# EAGLE design mosquino-power-pjt (EAGLE 5.06)
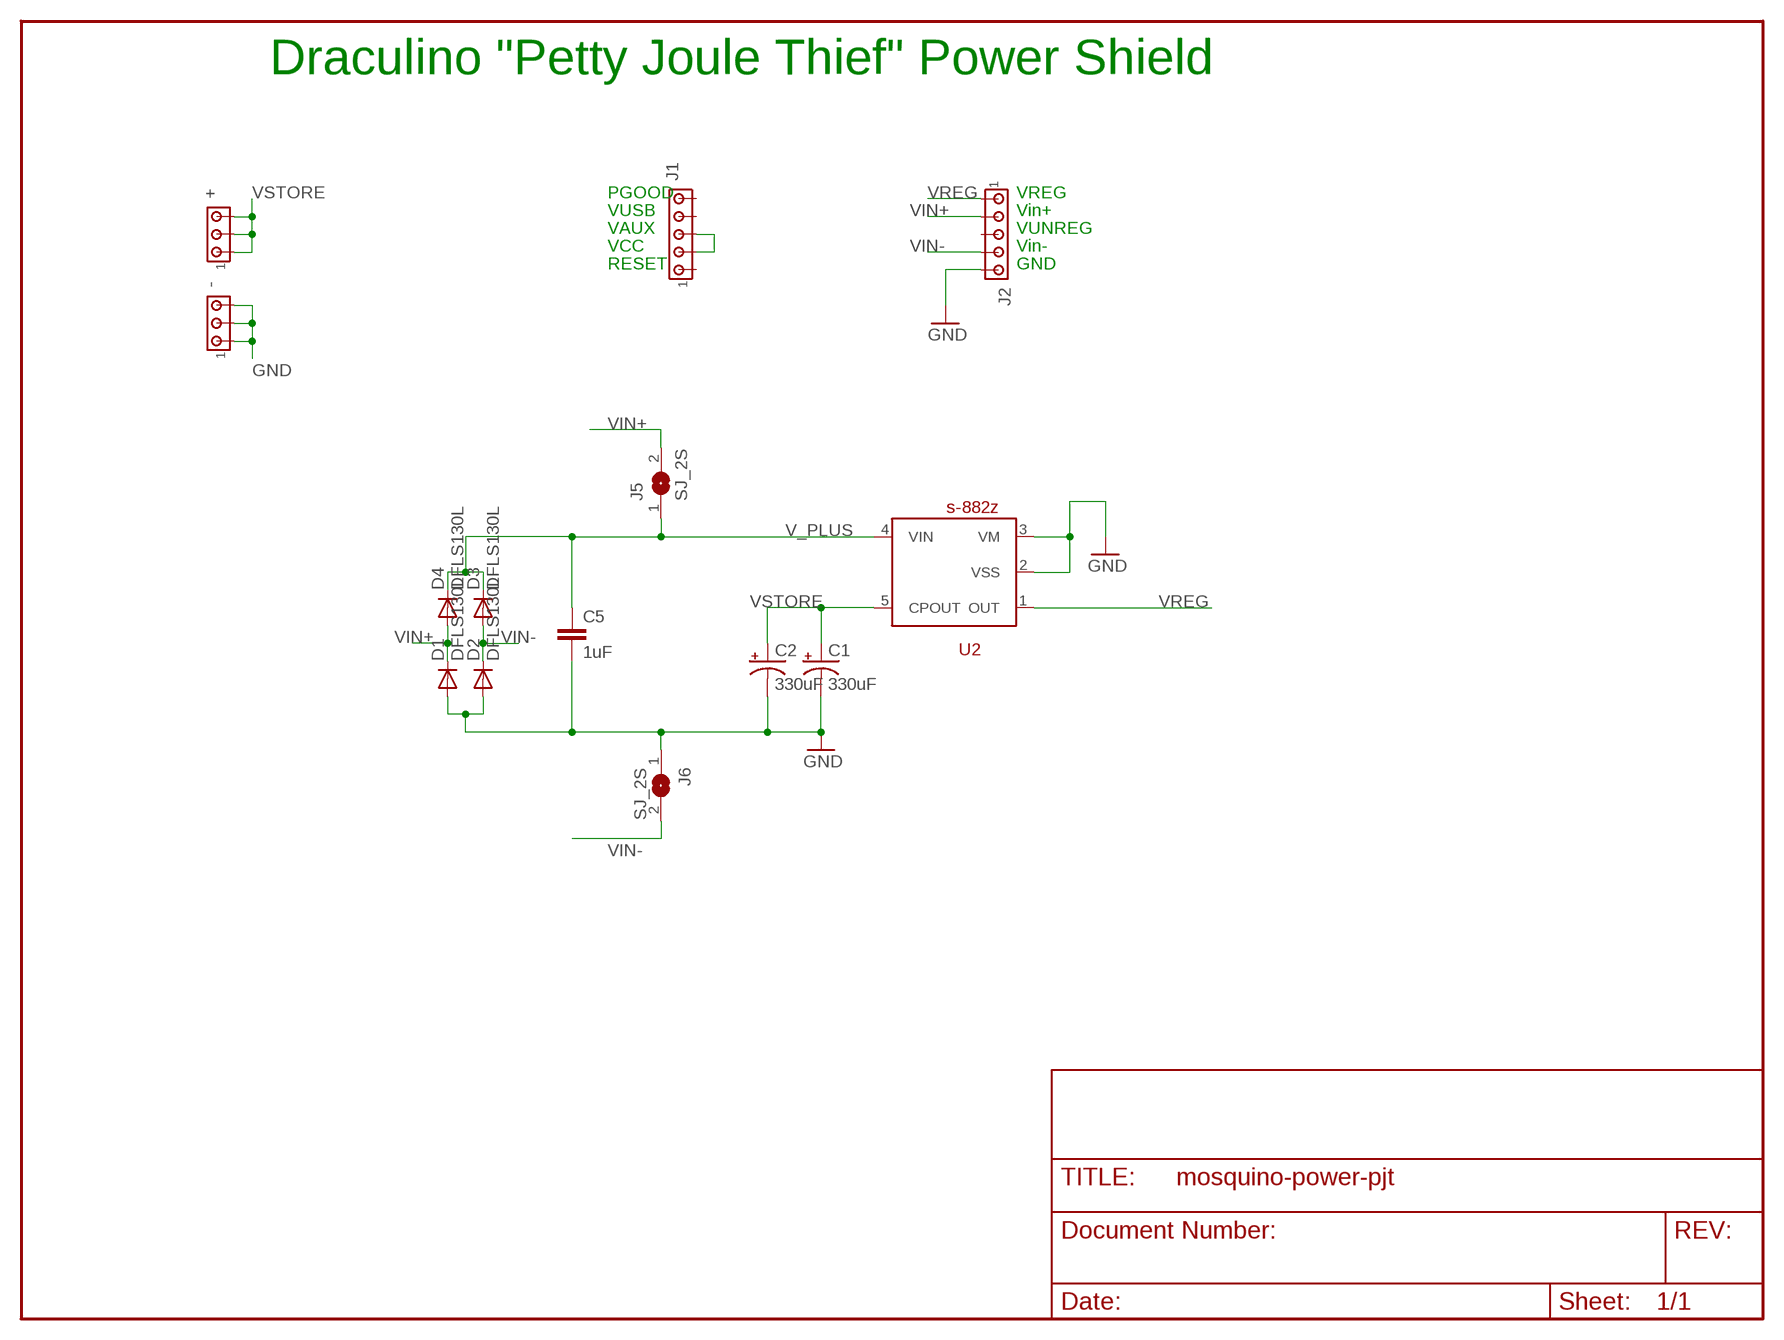
[diagram p0: schematic, sheet 1]

## Parts
+  MTA03-100  [10X03MTA]
-  MTA03-100  [10X03MTA]
C1  330uF  CPOL-USD  [PANASONIC_D]
C2  330uF  CPOL-USD  [PANASONIC_D]
C5  1uF  C-EUC0805  [C0805]
D1  DFLS130L  DIODE-SOD123  [SOD123]
D2  DFLS130L  DIODE-SOD123  [SOD123]
D3  DFLS130L  DIODE-SOD123  [SOD123]
D4  DFLS130L  DIODE-SOD123  [SOD123]
J1  MTA05-100  [10X05MTA]
J2  MTA05-100  [10X05MTA]
J5  SJ_2S  [SJ2_S]
J6  SJ_2S  [SJ2_S]
U2  s-882z  S-882Z  [SOT23-5]

## Nets
GND [pwr]: -.1 -.2 -.3 C1.- C2.- C5.2 D1.A D2.A J2.5 J6.1 U2.2(VSS) U2.3(VM)
N$1 [pwr]: J1.2 J1.3
V_PLUS [pwr]: C5.1 D3.C D4.C J5.1 U2.4(VIN)
VIN+ [pwr]: D1.C D4.A J2.2 J5.2
VIN- [pwr]: D2.C D3.A J2.4 J6.2
VREG [pwr]: J2.1 U2.1(OUT)
VSTORE [pwr]: +.1 +.2 +.3 C1.+ C2.+ U2.5(CPOUT)
Unconnected: J1.1 J1.4 J1.5 J2.3

## Notes on the sheet
- Draculino "Petty Joule Thief" Power Shield
- PGOOD | VREG
- VUSB | Vin+
- VAUX | VUNREG
- VCC | Vin-
- RESET | GND

## Library data of the parts
+ - = con-amp:MTA03-100: AMP connector
C1 C2 = rcl:CPOL-US: POLARIZED CAPACITOR, American symbol
C5 = rcl:C-EU: CAPACITOR, European symbol
D1-D4 = diode:DIODE-: DIODE
J1 J2 = con-amp:MTA05-100: AMP connector
J5 J6 = mideeval:SJ_2S: Small solder jumper, 2 pin. 20060130 / tgipson
U2 = tim:S-882Z: S-882Z series ultralow input voltage step-up converter. 20100817 / tgipson

## Net classes
1 pwr: width 0.305 mm, drill 0.508 mm, clearance 0.203 mm
4 digital: width 0.203 mm, drill 0.381 mm, clearance 0.203 mm

## Board
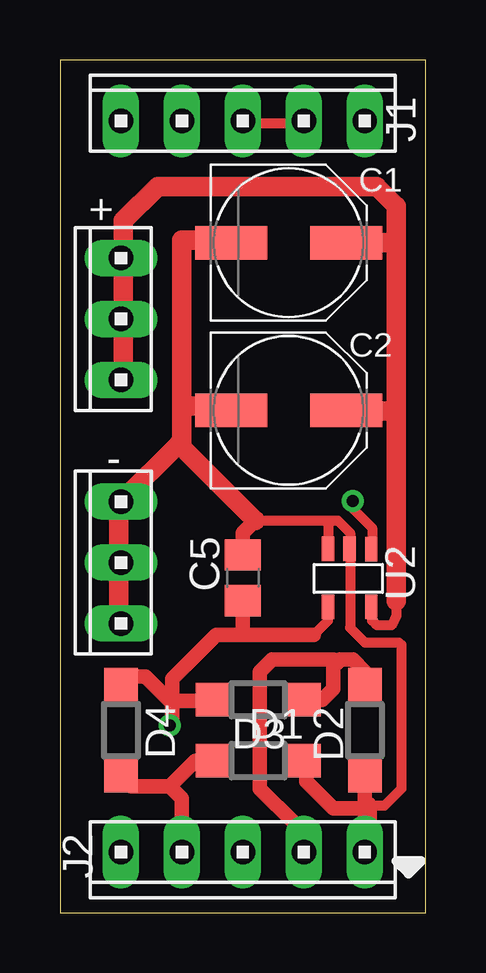
[diagram p1: board, top side]
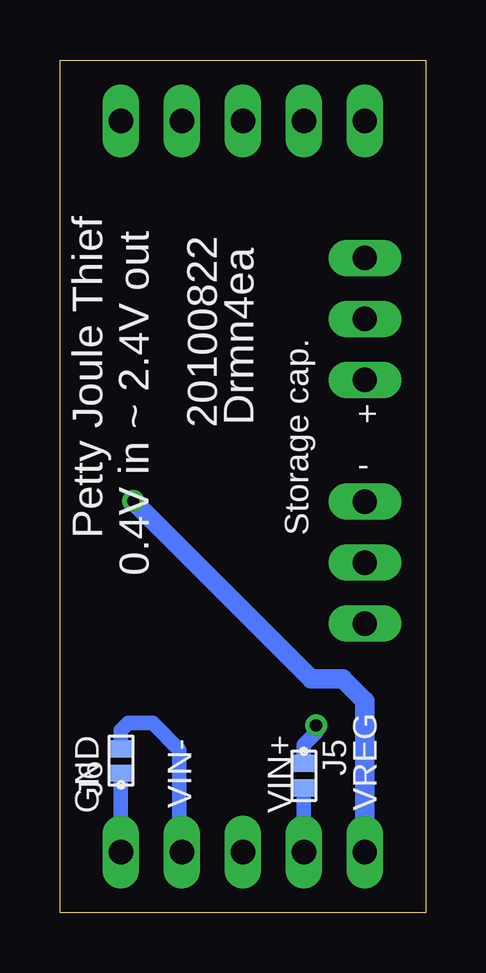
[diagram p2: board, bottom side, seen from below]

Size 15.24 x 35.56 mm. Coordinates in mm from the lower left corner, seen from the top.
Outline: 0,0 15.24,0 15.24,35.56 0,35.56 0,0
Copper layers (1*16): Top 0.035mm / dielectric 1.5mm / Bottom 0.035mm
Design rules "default": minimum track width 8mil, minimum drill 15mil, track to track 8mil, track to pad 8mil, pad to pad 8mil, via to via 8mil, smd to smd 8mil, copper to edge 40mil, drill to drill 8mil, minimum pad ring 10mil, minimum via ring 8mil, stop-mask expansion 4mil, vias tented up to drill 0mil, thermal gap 10mil

### Footprints (pad centres in the part's own frame; a part is rotated, then mirrored left to right if it is on the bottom)
10X03MTA = drill 1.016 long: 1 2.54,0; 2 0,0; 3 -2.54,0
PANASONIC_D = smd 3 x 1.4: + 2.4,0; - -2.4,0
C0805 = smd 1.3 x 1.5: 1 -0.95,0; 2 0.95,0
SOD123 = smd 1.4 x 1.4: A 1.9,0; C -1.9,0
10X05MTA = drill 1.016 long: 1 5.08,0; 2 2.54,0; 3 0,0; 4 -2.54,0; 5 -5.08,0
SJ2_S = smd 0.7 x 0.9: 1 -0.523,0; 2 0.493,0
SOT23-5 = smd 0.508 x 1.016: 1 -0.9,-1.2; 2 0,-1.21; 3 0.9,-1.21; 4 0.9,1.2; 5 -0.9,1.2

### Placement (x,y rotation side)
+  2.54,24.77 90 top
-  2.54,14.61 90 top
C1  9.53,27.94 0 top
C2  9.53,20.95 0 top
C5  7.62,13.97 90 top
D1  8.26,6.35 0 top
D2  12.7,7.62 270 top
D3  8.26,8.89 0 top
D4  2.54,7.62 270 top
J1  7.62,33.02 0 top
J2  7.62,2.54 180 top
J5  5.08,5.71 270 bottom
J6  12.7,6.35 90 bottom
U2  12.06,13.97 180 top

### Tracks (layer width: path | path; a pad name or v marks a point on that pad's centre or on a via)
GND
  Top 0.305: 12.8,4.37 12.5,4.37
  Top 0.406: 12.8,4.47 13.51,4.47 14.22,5.18 14.22,11.18 14.12,11.28 12.7,11.28 12.09,11.89 12.09,15.15 U2.2 12.09,15.21 12.09,15.85 11.58,16.36 11.18,16.36 | 8.13,16.36 11.18,16.36 | U2.3 11.18,15.19 11.18,16.36
  Top 0.61: 8.13,16.36 7.62,15.85 C5.2 | D1.A 10.26,6.24 10.26,5.49 11.38,4.37 12.5,4.37 12.7,4.37 D2.A
  Top 0.813: C1.- 7.02,28.04 5.08,28.04 5.08,21.13 | C2.- 6.95,21.13 5.08,21.13 | -.3 2.44,12.17 2.44,14.5 -.2 2.44,14.71 2.44,17.04 -.1 4.94,19.55 | 4.94,19.55 5.08,19.68 5.08,21.13 | J2.5 12.8,2.64 12.8,4.37 12.8,4.47 | 4.94,19.55 8.13,16.36
  Bottom 0.305: 12.7,5.89 J6.1 12.7,5.79
  Bottom 0.61: J2.5 12.7,5.79
N$1
  Top 0.406: J1.2 10.16,32.92 7.72,32.92 J1.3
V_PLUS  (via drill 0.51)
  Top 0.406: U2.4 11.18,12.76 11.18,12.19 10.57,11.58
  Top 0.61: 4.67,8.84 4.57,8.84 3.56,9.86 2.54,9.86 D4.C | v4.57,7.82 4.67,7.92 4.67,8.84 | 7.62,11.58 6.5,11.58 4.67,9.75 4.67,8.84 | 7.62,11.58 10.57,11.58 | 7.62,11.58 C5.1 | D3.C 6.3,8.84 4.67,8.84
  Bottom 0.61: J5.1 5.08,7.01 4.57,7.52 v4.57,7.82
VIN+
  Top 0.61: 4.57,5.28 5.08,4.78 J2.2 | D4.A 2.98,5.28 4.57,5.28 | 4.57,5.28 5.64,6.35 D1.C
  Bottom 0.61: J2.2 J5.2
VIN-
  Top 0.61: 11.53,10.41 11.38,10.26 11.38,9.35 10.92,8.89 D3.A | 11.53,10.41 11.68,10.57 12.19,10.57 12.7,10.06 D2.C | J2.4 9.75,2.95 9.75,3.76 8.33,5.18 8.33,10.06 8.84,10.57 11.38,10.57 11.53,10.41
  Bottom 0.61: J6.2 12.7,7.62 12.39,7.92 11.38,7.92 10.26,6.81 10.26,2.64 J2.4
VREG  (via drill 0.51)
  Top 0.406: U2.1 13.01,15.21 13.01,16.05 12.19,16.87 v12.19,17.17
  Bottom 0.813: v12.19,17.17 4.78,9.75 3.45,9.75 2.54,8.84 J2.1
VSTORE
  Top 0.406: U2.5 13.01,12.73 13.01,12.19 13.21,11.99 13.82,11.99 14.02,12.39 14.02,13.01
  Top 0.813: 2.64,24.77 2.64,24.79 | +.3 2.64,22.23 2.64,24.77 | 2.64,24.77 +.2 | 2.64,24.77 2.64,27.3 +.1 2.64,27.41 2.64,28.85 4.06,30.28 13.21,30.28 14.02,29.46 14.02,27.94 | 14.02,27.94 C1.+ | C2.+ 11.95,20.93 14.02,20.93 | 14.02,27.94 14.02,20.93 | 14.02,20.93 14.02,13.01

### Text on the board
bNames: Petty Joule Thief | Drmn4ea | 20100822 | 0.4V in ~ 2.4V out | + | - | Storage cap. | VREG | VIN+ | VIN- | GND